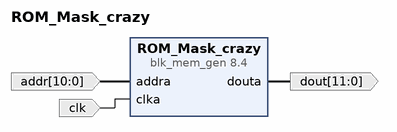
[diagram p0: block diagram of the top level]
# Vivado block design ROM_Mask_crazy, xc7k160tffg676-2L, Vivado 2019.2
create_bd_design ROM_Mask_crazy

create_bd_port -dir I -from 10 -to 0 addr
create_bd_port -dir I clk
create_bd_port -dir O -from 11 -to 0 dout

create_bd_cell -type ip -vlnv xilinx.com:ip:blk_mem_gen:8.4 ROM_Mask_crazy
set_property -dict [list \
  CONFIG.Coe_File ../../mask_crazy.coe \
  CONFIG.Enable_32bit_Address false \
  CONFIG.Enable_A Always_Enabled \
  CONFIG.Load_Init_File true \
  CONFIG.Memory_Type Single_Port_ROM \
  CONFIG.Port_A_Write_Rate 0 \
  CONFIG.Register_PortA_Output_of_Memory_Primitives true \
  CONFIG.Use_RSTA_Pin false \
  CONFIG.Write_Depth_A 2048 \
  CONFIG.Write_Width_A 12 \
  CONFIG.use_bram_block Stand_Alone \
] [get_bd_cells ROM_Mask_crazy]

# ---- connections ----

connect_bd_net [get_bd_ports addr] [get_bd_pins ROM_Mask_crazy/addra]
connect_bd_net [get_bd_ports clk] [get_bd_pins ROM_Mask_crazy/clka]
connect_bd_net [get_bd_pins ROM_Mask_crazy/douta] [get_bd_ports dout]

validate_bd_design
save_bd_design
